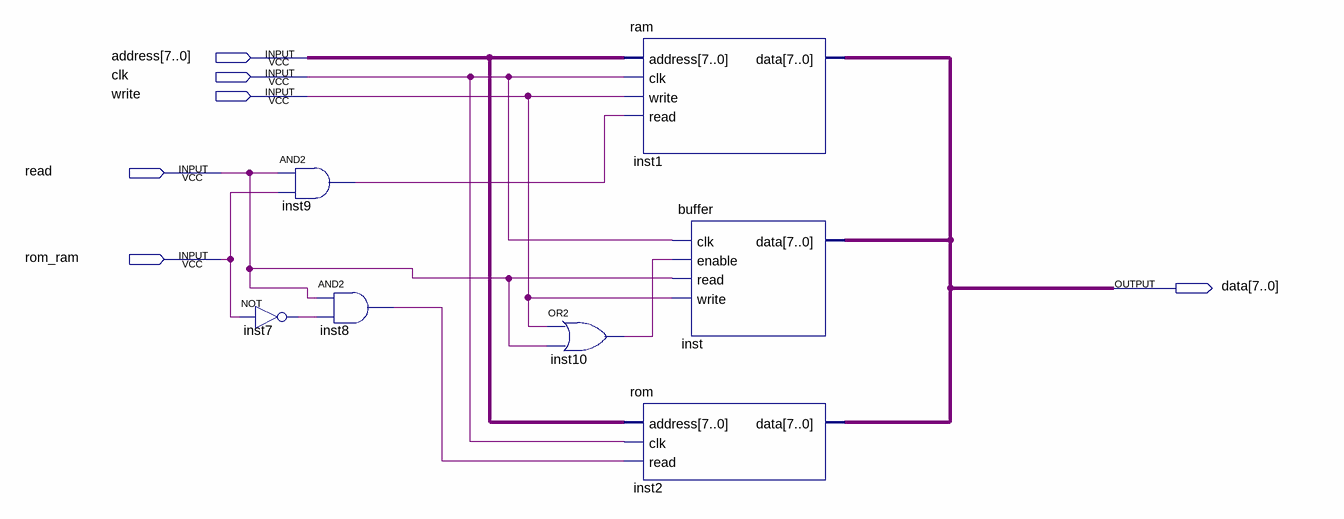
[diagram p0: schematic sheet]
// Quartus schematic lab3.bdf as structural Verilog: 7 symbols, 6 pins
module lab3 (
  input  [7:0] address,
  input  clk,
  input  write,
  input  read,
  input  rom_ram,
  output [7:0] data
);

  wire inst7_out, inst8_out, inst9_out, inst10_out;

  not inst7 (inst7_out, rom_ram);
  and inst9 (inst9_out, read, rom_ram);
  and inst8 (inst8_out, read, inst7_out);
  or inst10 (inst10_out, write, read);
  ram inst1 (.address(address), .clk(clk), .write(write), .read(inst9_out), .data(data));
  rom inst2 (.address(address), .clk(clk), .read(inst8_out), .data(data));
  buffer inst (.clk(clk), .enable(inst10_out), .read(read), .write(write), .data(data));
endmodule
